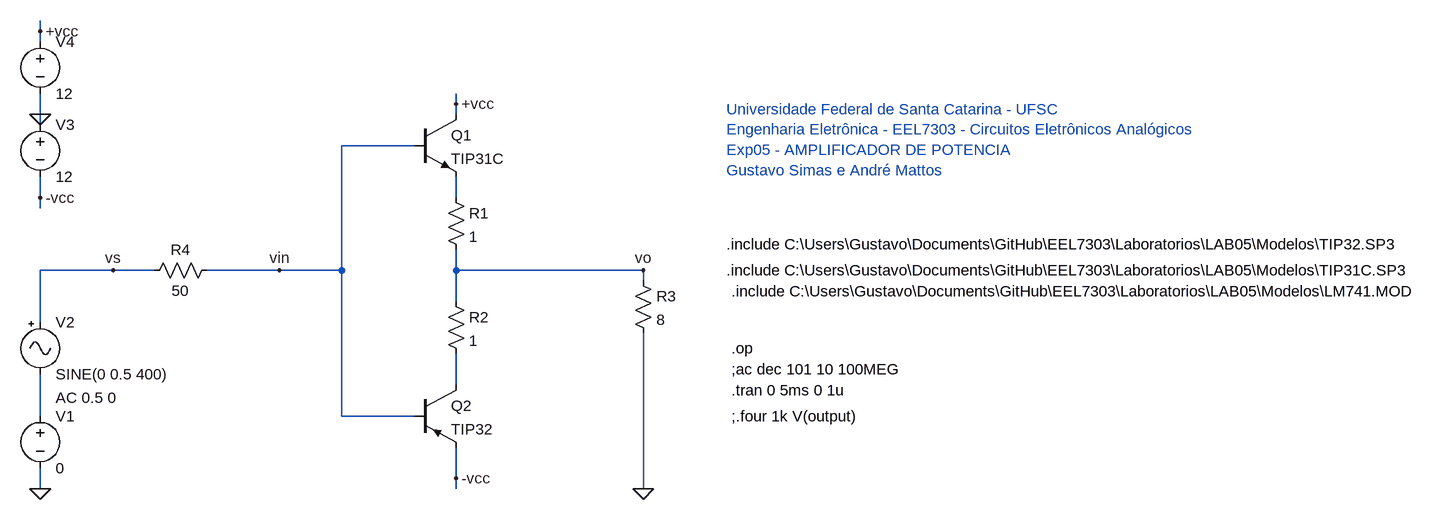
[diagram p0: schematic Lab05.asc]
Lab05.asc, the LTspice schematic file:
Version 4
SHEET 1 2316 680
WIRE 80 -432 80 -448
WIRE 80 -416 80 -432
WIRE 720 -320 720 -336
WIRE 80 -304 80 -336
WIRE 720 -304 720 -320
WIRE 80 -288 80 -304
WIRE 656 -256 544 -256
WIRE 80 -176 80 -208
WIRE 720 -176 720 -208
WIRE 80 -160 80 -176
WIRE 192 -64 80 -64
WIRE 256 -64 192 -64
WIRE 448 -64 336 -64
WIRE 544 -64 544 -256
WIRE 544 -64 448 -64
WIRE 720 -64 720 -96
WIRE 1008 -64 720 -64
WIRE 1008 -48 1008 -64
WIRE 720 -16 720 -64
WIRE 80 16 80 -64
WIRE 720 112 720 64
WIRE 80 160 80 96
WIRE 544 160 544 -64
WIRE 656 160 544 160
WIRE 720 256 720 208
WIRE 80 272 80 240
WIRE 720 272 720 256
WIRE 1008 272 1008 32
FLAG 80 -304 0
FLAG 80 -432 +vcc
FLAG 80 -176 -vcc
FLAG 720 256 -vcc
FLAG 720 -320 +vcc
FLAG 1008 272 0
FLAG 1008 -64 vo
FLAG 192 -64 vs
FLAG 80 272 0
FLAG 448 -64 vin
SYMBOL voltage 80 144 R0
WINDOW 123 0 0 Left 0
WINDOW 39 0 0 Left 0
SYMATTR InstName V1
SYMATTR Value 0
SYMBOL Misc\\signal 80 0 R0
WINDOW 123 24 132 Left 2
WINDOW 39 0 0 Left 0
SYMATTR Value2 AC 0.5 0
SYMATTR InstName V2
SYMATTR Value SINE(0 0.5 400)
SYMBOL npn 656 -304 R0
SYMATTR InstName Q1
SYMATTR Value TIP31C
SYMBOL res 704 -192 R0
SYMATTR InstName R1
SYMATTR Value 1
SYMBOL res 704 -32 R0
SYMATTR InstName R2
SYMATTR Value 1
SYMBOL pnp 656 112 R0
SYMATTR InstName Q2
SYMATTR Value TIP32
SYMBOL voltage 80 -304 R0
SYMATTR InstName V3
SYMATTR Value 12
SYMBOL voltage 80 -432 R0
SYMATTR InstName V4
SYMATTR Value 12
SYMBOL res 992 -64 R0
SYMATTR InstName R3
SYMATTR Value 8
SYMBOL res 352 -80 R90
WINDOW 0 0 56 VBottom 2
WINDOW 3 32 56 VTop 2
SYMATTR InstName R4
SYMATTR Value 50
TEXT 1136 -64 Left 2 !.include C:\\Users\\Gustavo\\Documents\\GitHub\\EEL7303\\Laboratorios\\LAB05\\Modelos\\TIP31C.SP3
TEXT 1136 -312 Left 2 ;Universidade Federal de Santa Catarina - UFSC\nEngenharia Eletrônica - EEL7303 - Circuitos Eletrônicos Analógicos\nExp05 - AMPLIFICADOR DE POTENCIA\nGustavo Simas e André Mattos
TEXT 1144 -32 Left 2 !.include C:\\Users\\Gustavo\\Documents\\GitHub\\EEL7303\\Laboratorios\\LAB05\\Modelos\\LM741.MOD
TEXT 1136 -104 Left 2 !.include C:\\Users\\Gustavo\\Documents\\GitHub\\EEL7303\\Laboratorios\\LAB05\\Modelos\\TIP32.SP3
TEXT 1144 120 Left 2 !.tran 0 5ms 0 1u
TEXT 1144 56 Left 2 !.op
TEXT 1144 160 Left 2 !;.four 1k V(output)
TEXT 1144 88 Left 2 !;ac dec 101 10 100MEG

The netlist it stands for:
* Lab05.asc
V1 N003 0 0
V2 vs N003 SINE(0 0.5 400) AC 0.5 0
Q1 +vcc vin N001 0 TIP31C
R1 N001 vo 1
R2 vo N002 1
Q2 N002 vin -vcc 0 TIP32
V3 0 -vcc 12
V4 +vcc 0 12
R3 vo 0 8
R4 vin vs 50
.model NPN NPN
.model PNP PNP
.lib standard.bjt
.include C:\Users\Gustavo\Documents\GitHub\EEL7303\Laboratorios\LAB05\Modelos\TIP31C.SP3
* Universidade Federal de Santa Catarina - UFSC
* Engenharia Eletrônica - EEL7303 - Circuitos Eletrônicos Analógicos
* Exp05 - AMPLIFICADOR DE POTENCIA
* Gustavo Simas e André Mattos
.include C:\Users\Gustavo\Documents\GitHub\EEL7303\Laboratorios\LAB05\Modelos\LM741.MOD
.include C:\Users\Gustavo\Documents\GitHub\EEL7303\Laboratorios\LAB05\Modelos\TIP32.SP3
.tran 0 5ms 0 1u
.op
;.four 1k V(output)
;ac dec 101 10 100MEG
.backanno
.end

* Results of the author's LTspice run, read from the files saved beside the schematic
* Operating Point, zero values left out:
*   V(+vcc) = 12 V
*   V(vin) = 549.6 nV
*   V(-vcc) = -12 V
*   Ic(Q2) = 1.12 nA
*   Ib(Q2) = 19.59 pA
*   Ie(Q2) = -1.14 nA
*   Ic(Q1) = 13.21 nA
*   Ib(Q1) = -11.01 nA
*   Ie(Q1) = -2.2 nA
*   I(R4) = 10.99 nA
*   I(R3) = 1.08 nA
*   I(R2) = 1.12 nA
*   I(R1) = 2.2 nA
*   I(V4) = -13.21 nA
*   I(V3) = -1.139 nA
*   I(V2) = 10.99 nA
*   I(V1) = 10.99 nA
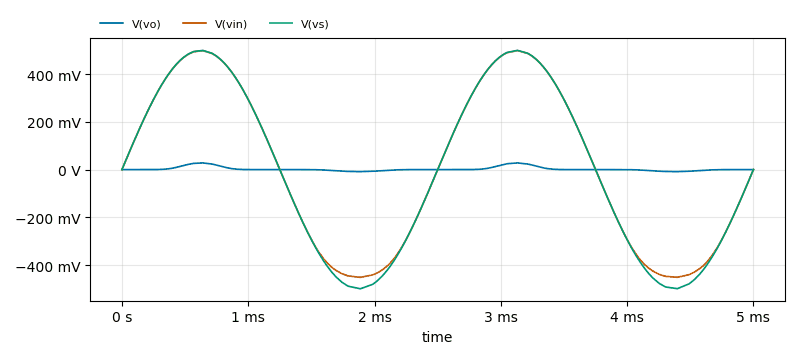
[diagram p1: Transient Analysis of Lab05.asc, plotted from the saved traces]
* Transient Analysis, 1 run:
*   V(vo): min -8.494 mV, max 28.14 mV, average 2.31 mV, rms 9.111 mV, last 6.386 µV
*   V(vin): min -451.8 mV, max 498.9 mV, average 7.452 mV, rms 343.3 mV, last -48.77 µV
*   V(vs): min -499.7 mV, max 499.9 mV, average 105.7 µV, rms 353.1 mV, last 0 V